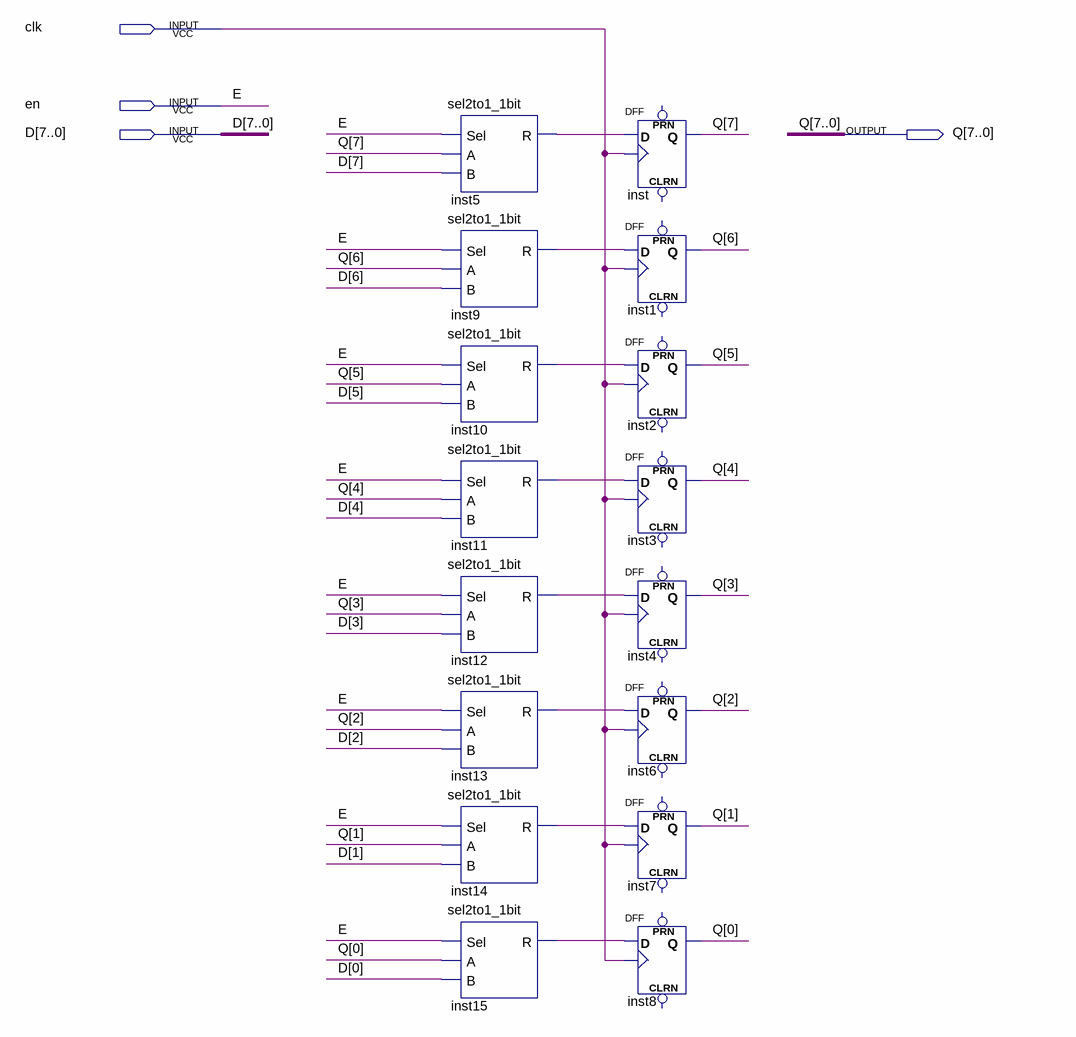
[diagram p0: schematic sheet]
// Quartus schematic register_8bit.bdf as structural Verilog: 16 symbols, 4 pins
module register_8bit (
  input  clk,
  input  en,
  input  [7:0] D,
  output [7:0] Q
);

  wire inst5_r, inst9_r, inst10_r, inst11_r, inst12_r, inst13_r, inst14_r, inst15_r;

  sel2to1_1bit inst5 (.Sel(en), .A(Q[7]), .B(D[7]), .R(inst5_r));
  sel2to1_1bit inst9 (.Sel(en), .A(Q[6]), .B(D[6]), .R(inst9_r));
  sel2to1_1bit inst10 (.Sel(en), .A(Q[5]), .B(D[5]), .R(inst10_r));
  sel2to1_1bit inst11 (.Sel(en), .A(Q[4]), .B(D[4]), .R(inst11_r));
  sel2to1_1bit inst12 (.Sel(en), .A(Q[3]), .B(D[3]), .R(inst12_r));
  sel2to1_1bit inst13 (.Sel(en), .A(Q[2]), .B(D[2]), .R(inst13_r));
  sel2to1_1bit inst14 (.Sel(en), .A(Q[1]), .B(D[1]), .R(inst14_r));
  sel2to1_1bit inst15 (.Sel(en), .A(Q[0]), .B(D[0]), .R(inst15_r));
  DFF inst (.CLK(clk), .D(inst5_r), .Q(Q[7]));  // open: CLRN, PRN
  DFF inst1 (.CLK(clk), .D(inst9_r), .Q(Q[6]));  // open: CLRN, PRN
  DFF inst2 (.CLK(clk), .D(inst10_r), .Q(Q[5]));  // open: CLRN, PRN
  DFF inst3 (.CLK(clk), .D(inst11_r), .Q(Q[4]));  // open: CLRN, PRN
  DFF inst4 (.CLK(clk), .D(inst12_r), .Q(Q[3]));  // open: CLRN, PRN
  DFF inst6 (.CLK(clk), .D(inst13_r), .Q(Q[2]));  // open: CLRN, PRN
  DFF inst7 (.CLK(clk), .D(inst14_r), .Q(Q[1]));  // open: CLRN, PRN
  DFF inst8 (.CLK(clk), .D(inst15_r), .Q(Q[0]));  // open: CLRN, PRN

  // Other names for the same wires on the sheet: E = en
endmodule
